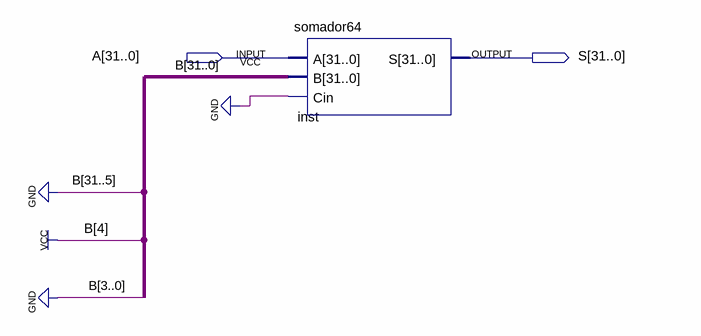
[diagram p0: schematic sheet]
// Quartus schematic pc4.bdf as structural Verilog: 1 symbols, 2 pins
module pc4 (
  input  [31:0] A,
  output [31:0] S
);

  somador64 inst (.A(A), .B(32'b00000000000000000000000000010000), .Cin(1'b0), .S(S));
endmodule
